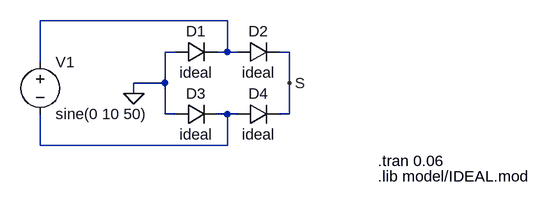
[diagram p0: schematic full_wave_rectifier.asc]
full_wave_rectifier.asc, the LTspice schematic file:
Version 4
SHEET 1 1760 680
WIRE 1296 112 1008 112
WIRE 1216 160 1200 160
WIRE 1296 160 1296 112
WIRE 1296 160 1280 160
WIRE 1312 160 1296 160
WIRE 1392 160 1376 160
WIRE 1008 176 1008 112
WIRE 1200 208 1200 160
WIRE 1200 208 1152 208
WIRE 1392 208 1392 160
WIRE 1152 224 1152 208
WIRE 1200 256 1200 208
WIRE 1216 256 1200 256
WIRE 1296 256 1280 256
WIRE 1312 256 1296 256
WIRE 1392 256 1392 208
WIRE 1392 256 1376 256
WIRE 1008 304 1008 256
WIRE 1296 304 1296 256
WIRE 1296 304 1008 304
FLAG 1152 224 0
FLAG 1392 208 S
SYMBOL diode 1216 176 R270
WINDOW 0 32 32 VTop 2
WINDOW 3 0 32 VBottom 2
SYMATTR InstName D1
SYMATTR Value ideal
SYMBOL diode 1312 176 R270
WINDOW 0 32 32 VTop 2
WINDOW 3 0 32 VBottom 2
SYMATTR InstName D2
SYMATTR Value ideal
SYMBOL diode 1216 272 R270
WINDOW 0 32 32 VTop 2
WINDOW 3 0 32 VBottom 2
SYMATTR InstName D3
SYMATTR Value ideal
SYMBOL diode 1312 272 R270
WINDOW 0 32 32 VTop 2
WINDOW 3 0 32 VBottom 2
SYMATTR InstName D4
SYMATTR Value ideal
SYMBOL voltage 1008 160 R0
SYMATTR InstName V1
SYMATTR Value sine(0 10 50)
TEXT 1528 352 Left 2 !.lib model/IDEAL.mod
TEXT 1528 328 Left 2 !.tran 0.06

The netlist it stands for:
* full_wave_rectifier.asc
D1 0 N001 ideal
D2 N001 S ideal
D3 0 N002 ideal
D4 N002 S ideal
V1 N001 N002 sine(0 10 50)
.model D D
.lib standard.dio
.lib model/IDEAL.mod
.tran 0.06
.backanno
.end